# Altium schematic sheet USB_Control.SchDoc
size A
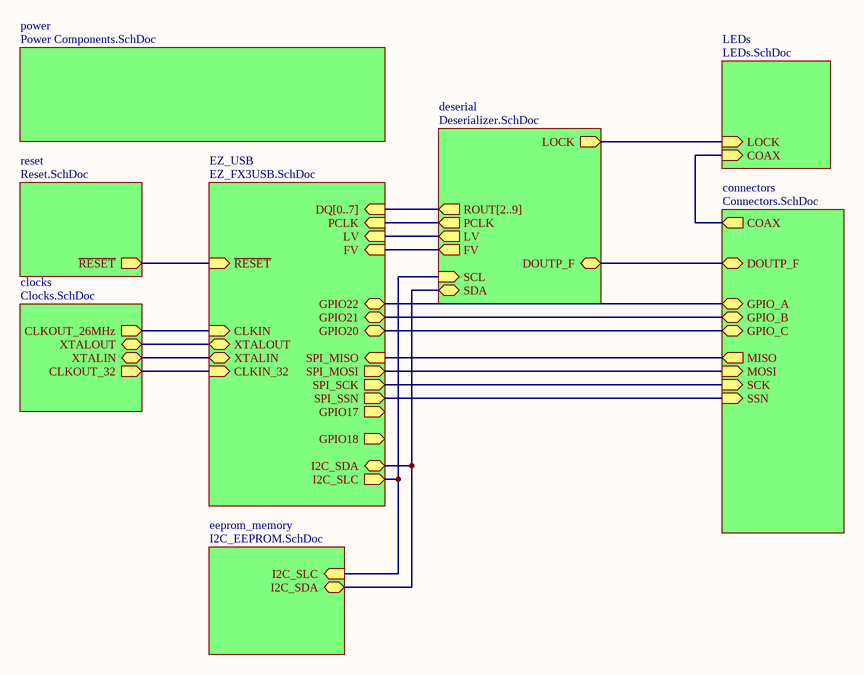
[diagram p0: USB_Control.SchDoc]

## Sub-sheets
clocks = Clocks.SchDoc: XTALOUT, XTALIN, CLKOUT_32 (out), CLKOUT_26MHz (out)
connectors = Connectors.SchDoc: GPIO_A (bidir), GPIO_B (bidir), GPIO_C (bidir), DOUTP_F (bidir), MISO (out), MOSI (in), SCK (in), SSN (in), COAX (out)
deserial = Deserializer.SchDoc: LOCK (out), LV (out), FV (out), PCLK (out), DOUTP_F (bidir), SCL (in), SDA (bidir), ROUT[2..9] (out)
eeprom_memory = I2C_EEPROM.SchDoc: I2C_SDA (bidir), I2C_SLC (in)
EZ_USB = EZ_FX3USB.SchDoc: PCLK (in), SPI_SCK (out), SPI_SSN (out), SPI_MISO (in), SPI_MOSI (out), CLKIN_32 (in), XTALOUT, XTALIN, I2C_SDA (bidir), I2C_SLC (out), ~{RESET} (in), GPIO17 (out), GPIO20 (bidir), GPIO18 (out), DQ[0..7] (in), GPIO22 (bidir), GPIO21 (bidir), LV (in), FV (in), CLKIN (in)
LEDs = LEDs.SchDoc: LOCK (in), COAX (in)
power = Power Components.SchDoc: no entries
reset = Reset.SchDoc: ~{RESET} (out)

## Nets
(unnamed): sheet deserial/LOCK, sheet LEDs/LOCK
(unnamed): sheet deserial/LV, sheet EZ_USB/LV
(unnamed): sheet deserial/FV, sheet EZ_USB/FV
(unnamed): sheet deserial/PCLK, sheet EZ_USB/PCLK
(unnamed): sheet deserial/DOUTP_F, sheet connectors/DOUTP_F
(unnamed): sheet deserial/SCL, sheet EZ_USB/I2C_SLC, sheet eeprom_memory/I2C_SLC
(unnamed): sheet deserial/SDA, sheet EZ_USB/I2C_SDA, sheet eeprom_memory/I2C_SDA
(unnamed): sheet EZ_USB/SPI_SCK, sheet connectors/SCK
(unnamed): sheet EZ_USB/SPI_SSN, sheet connectors/SSN
(unnamed): sheet EZ_USB/SPI_MISO, sheet connectors/MISO
(unnamed): sheet EZ_USB/SPI_MOSI, sheet connectors/MOSI
(unnamed): sheet EZ_USB/CLKIN_32, sheet clocks/CLKOUT_32
(unnamed): sheet EZ_USB/XTALOUT, sheet clocks/XTALOUT
(unnamed): sheet EZ_USB/XTALIN, sheet clocks/XTALIN
(unnamed): sheet EZ_USB/~{RESET}, sheet reset/~{RESET}
(unnamed): sheet EZ_USB/GPIO20, sheet connectors/GPIO_C
(unnamed): sheet EZ_USB/GPIO22, sheet connectors/GPIO_A
(unnamed): sheet EZ_USB/GPIO21, sheet connectors/GPIO_B
(unnamed): sheet EZ_USB/CLKIN, sheet clocks/CLKOUT_26MHz
(unnamed): sheet connectors/COAX, sheet LEDs/COAX

## Buses and harness runs
bus sheet deserial/ROUT[2..9] = sheet EZ_USB/DQ[0..7]